# EasyEDA Pro project ProPrj_Shell Controller_2025-04-30.epro

# Schematic Schematic1
Board Name: Board1; Create Date: 2024-11-05; Page Name: P1; Project Name: Shell Controller; Schematic Name: Schematic1; Update Date: 2024-11-13; Company: EasyEDA.com; Drawn: EasyEDA; Page Size: A4; Part Number: JLCPCB-002; Reviewed: EasyEDA; Version: V0.1
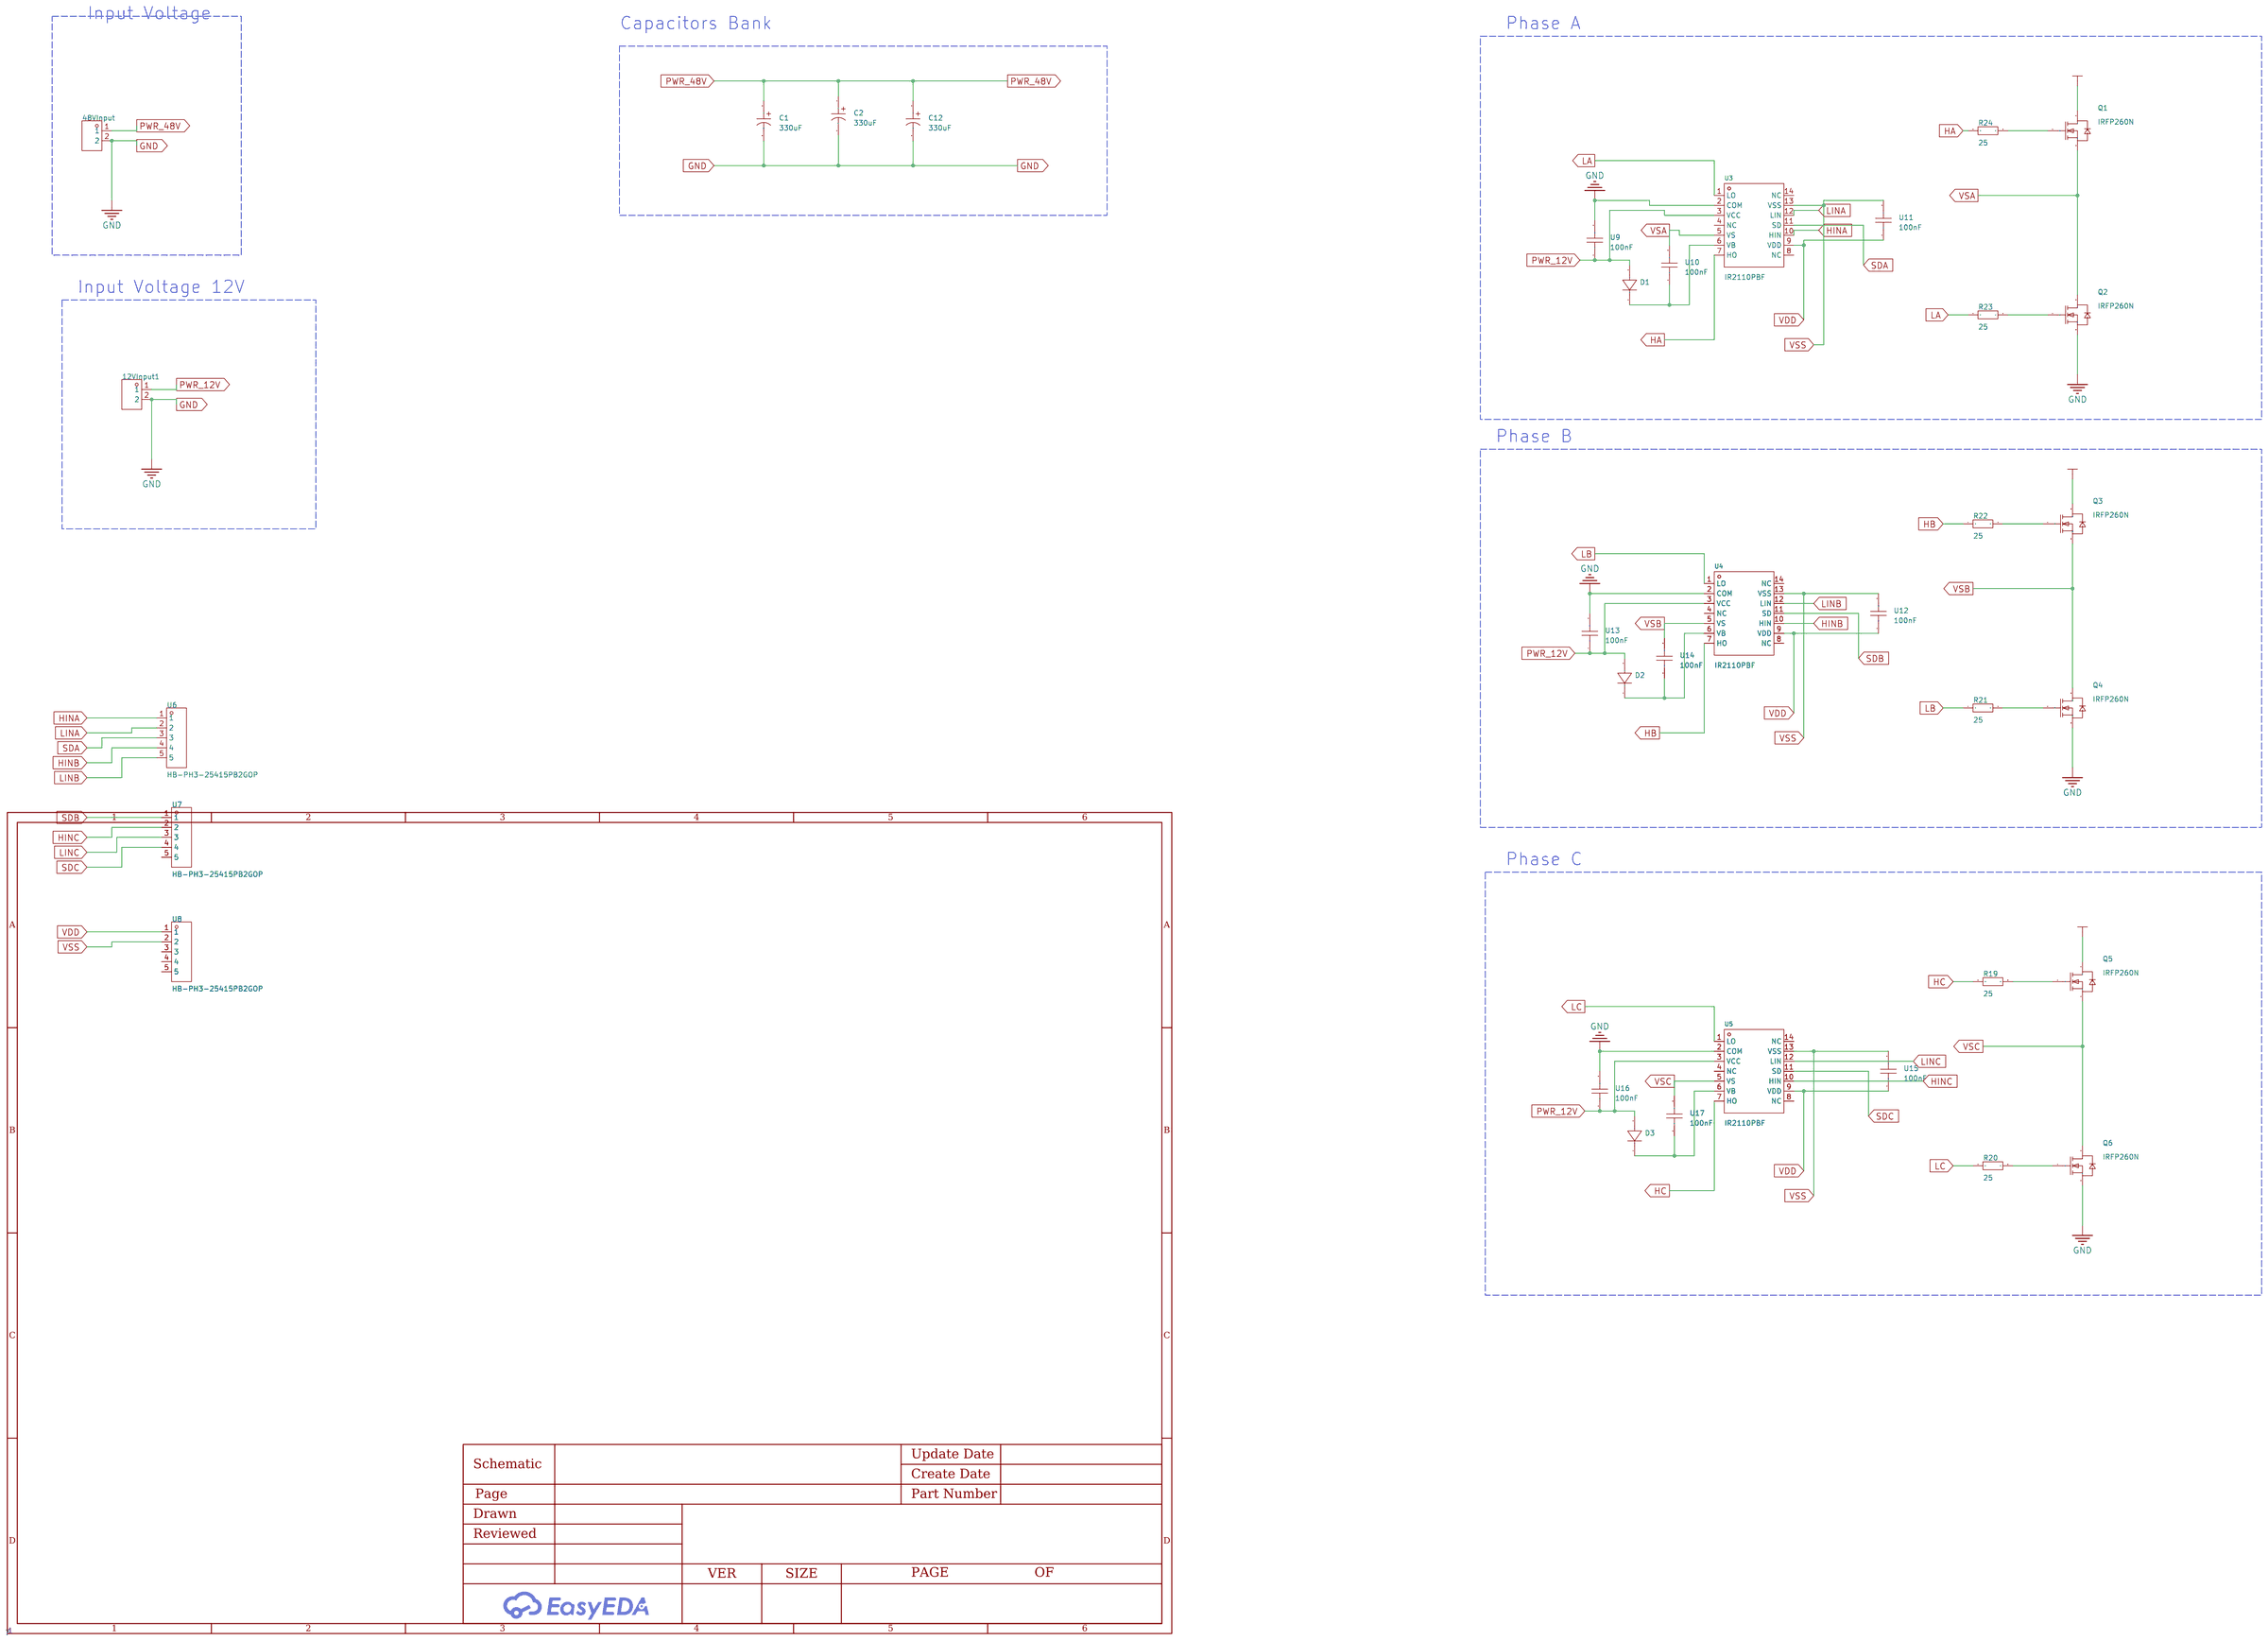
[diagram p0: schematic sheet]

## Parts
12VInput1  DBT50G-9.5-2P-BK-P OGC  [CONN-TH_2P-P9.50_DBT50G-9.5-2P]
48VInput  DBT50G-9.5-2P-BK-P OGC  [CONN-TH_2P-P9.50_DBT50G-9.5-2P]
C1  330uF  [CAP-TH_BD16.0-P7.50-D0.8-FD]
C2  330uF  [CAP-TH_BD16.0-P7.50-D0.8-FD]
C12  330uF  [CAP-TH_BD16.0-P7.50-D0.8-FD]
D1  -  [DO-41_BD2.4-L4.7-P8.70-D0.9-RD]
D2  -  [DO-41_BD2.4-L4.7-P8.70-D0.9-RD]
D3  -  [DO-41_BD2.4-L4.7-P8.70-D0.9-RD]
Q1  IRFP260N  [TO-247-3_L21.0-W15.9-P5.44-L]
Q2  IRFP260N  [TO-247-3_L21.0-W15.9-P5.44-L]
Q3  IRFP260N  [TO-247-3_L21.0-W15.9-P5.44-L]
Q4  IRFP260N  [TO-247-3_L21.0-W15.9-P5.44-L]
Q5  IRFP260N  [TO-247-3_L21.0-W15.9-P5.44-L]
Q6  IRFP260N  [TO-247-3_L21.0-W15.9-P5.44-L]
R19  25  [RES-TH_BD1.8-L3.2-P7.20-D0.4]
R20  25  [RES-TH_BD1.8-L3.2-P7.20-D0.4]
R21  25  [RES-TH_BD1.8-L3.2-P7.20-D0.4]
R22  25  [RES-TH_BD1.8-L3.2-P7.20-D0.4]
R23  25  [RES-TH_BD1.8-L3.2-P7.20-D0.4]
R24  25  [RES-TH_BD1.8-L3.2-P7.20-D0.4]
U3  IR2110PBF  [DIP-14_L20.0-W7.6-P2.54-LS7.6-BL]
U4  IR2110PBF  [DIP-14_L20.0-W7.6-P2.54-LS7.6-BL]
U5  IR2110PBF  [DIP-14_L20.0-W7.6-P2.54-LS7.6-BL]
U6  HB-PH3-25415PB2GOP  [HDR-TH_5P-P2.54-V-M]
U7  HB-PH3-25415PB2GOP  [HDR-TH_5P-P2.54-V-M]
U8  HB-PH3-25415PB2GOP  [HDR-TH_5P-P2.54-V-M]
U9  100nF  [CAP-TH_L5.5-W4.0-P5.00-D0.5]
U10  100nF  [CAP-TH_L5.5-W4.0-P5.00-D0.5]
U11  100nF  [CAP-TH_L5.5-W4.0-P5.00-D0.5]
U12  100nF  [CAP-TH_L5.5-W4.0-P5.00-D0.5]
U13  100nF  [CAP-TH_L5.5-W4.0-P5.00-D0.5]
U14  100nF  [CAP-TH_L5.5-W4.0-P5.00-D0.5]
U15  100nF  [CAP-TH_L5.5-W4.0-P5.00-D0.5]
U16  100nF  [CAP-TH_L5.5-W4.0-P5.00-D0.5]
U17  100nF  [CAP-TH_L5.5-W4.0-P5.00-D0.5]

## Library data of the parts
12VInput1 48VInput = DBT50G-9.5-2P-BK-P OGC: Barrier Type:With Cover Plate Pitch:9.5mm Structure:1x2P Mounting Style:Straight Needle Pin Location:Corner Number of Pins:2P Number of Rows:1 Current Rating (Max):32A Voltage Rating (Max):750V Wire Gauge - AWG:12~22 Wire Gauge - mm2:4 Operating Temperatu; LCSC Part Name: 9.5mm 1x2P 每排P数:2 排数:1 直针 边脚; Supplier Part: C395958; Manufacturer: DORABO(地博电气); Supplier Footprint: 插件,P=9.5mm; JLCPCB Part Class: Extended Part; Datasheet: https://atta.szlcsc.com/upload/public/pdf/source/20230619/13ADDB604F78DE06B1EFD4F82CE20A46.pdf; Supplier: LCSC; Barrier Type: With Cover Plate; Pitch: 9.5mm; Structure: 1x2P; Mounting Style: Straight Needle; Pin Location: Corner; Number of Pins: 2P; Number of Rows: 1; Current Rating (Max): 32A; Voltage Rating (Max): 750V; Wire Gauge - AWG: 12~22; Wire Gauge - mm2: 4; Operating Temperature Range: -40℃~+105℃; Color: Black; Number of PINs Per Row: 2
C1 C2 C12 = SHG330UF100V146EC0462: Capacitance: Tolerance:±20% Tolerance:±20% Rated Voltage: Ripple Current:- Equivalent Series Resistance(ESR):- Lead Spacing:- φD: L: Lifetime @ Temp:10000hrs@105℃ Operating Temperature:- Operating Temperature:-; LCSC Part Name: 330uF ±20% 100V; Supplier Part: C3034842; Manufacturer: KNSCHA(科尼盛); Supplier Footprint: 插件,D16xL20mm; JLCPCB Part Class: Extended Part; Datasheet: https://atta.szlcsc.com/upload/public/pdf/source/20220617/B6D709079D4B0523E96AE75949C6CFF6.pdf; Supplier: LCSC; Tolerance: ±20%; Lifetime @ Temp: 10000hrs@105℃
D1-D3 = 1N4007: Supplier Footprint: DO-41
Q1-Q6 = IRFP260N: Type: Drain Source Voltage (Vdss):- Continuous Drain Current (Id):- Drain Source On Resistance (RDS(on)@Vgs,Id):- Power Dissipation (Pd):- Gate Threshold Voltage (Vgs(th)@Id):- Total Gate Charge (Qg@Vgs):-; LCSC Part Name: N沟道50A 200V; Supplier Part: C33129608; Manufacturer: minos(迈诺斯); Supplier Footprint: TO-247; JLCPCB Part Class: Extended Part; Datasheet: https://atta.szlcsc.com/upload/public/pdf/source/20240723/7BE715932BC9A0E32EEBF4D219A57340.pdf; Supplier: LCSC
R19-R24 = Res_AXIAL-1/8W: Supplier Footprint: Through
U3-U5 = IR2110PBF: Driven Configuration:Half Bridge Load Type:MOSFET；IGBT Number of Drivers:2 Peak Output Current(sink):2A Peak Output Current(source):2A Supply Voltage:3.3V~20V Supply Voltage:3.3V~20V Rise Time:25ns Fall Time:17ns Operating Temperature:-40℃~+150℃@(Tj) Oper; Supplier Part: C2967; Manufacturer: Infineon(英飞凌); Supplier Footprint: DIP-14; JLCPCB Part Class: Extended Part; Datasheet: https://atta.szlcsc.com/upload/public/pdf/source/20190222/C371542_1B779ED12CDCFC0BFEA8323EC05804C9.pdf; Supplier: LCSC; Driven Configuration: Half Bridge; Load Type: MOSFET；IGBT; Number of Drivers: 2; Peak Output Current(sink): 2A; Peak Output Current(source): 2A; Supply Voltage: 3.3V~20V; Rise Time: 25ns; Fall Time: 17ns; Operating Temperature: -40℃~+150℃@(Tj)
U6-U8 = HB-PH3-25415PB2GOP: Pin Structure:1x5P Pitch:2.54mm Row Spacing:2.54mm Circluar Pins/Square Pins:Square Pins Mounting Type:Straight Number of Rows:Plugin Number of Pins:5P Current Rating (Max):3A Voltage Rating (Max):250V Length of Mating Pin:6mm Insulation Height:2.54mm Len; LCSC Part Name: 间距:2.54mm 1x5P 直插 方针; Supplier Part: C6332198; Manufacturer: HANBO(汉博); Supplier Footprint: 插件,P=2.54mm; JLCPCB Part Class: Extended Part; Datasheet: https://atta.szlcsc.com/upload/public/pdf/source/20230803/F72D259687963761DF1B552F3BB84A31.pdf; Supplier: LCSC; Pin Structure: 1x5P; Pitch: 2.54mm; Row Spacing: 2.54mm; Circluar Pins/Square Pins: Square Pins; Mounting Type: Straight; Number of Rows: Plugin; Number of Pins: 5P; Current Rating (Max): 3A; Voltage Rating (Max): 250V; Length of Mating Pin: 6mm; Insulation Height: 2.54mm; Length of End Connection Pin: 3mm; Contact Plating: Gold; Operating Temperature Range: -40℃~+105℃; Soldering Temperature(Max): 260℃; Color: Black
U9-U17 = Y5P102K1KV16CC0008: Capacitance: Tolerance:±10% Tolerance:±10% Voltage Rated: Lead Spacing: Temperature Coefficient: φD:- Body Thickness:-; LCSC Part Name: 1nF ±10% 1kV; Supplier Part: C2887268; Manufacturer: KNSCHA(科尼盛); Supplier Footprint: 插件,P=5mm; JLCPCB Part Class: Extended Part; Datasheet: https://atta.szlcsc.com/upload/public/pdf/source/20210824/9055597E21B72C2A365E56A1D1F6BF4B.pdf; Supplier: LCSC; Tolerance: ±10%

## Nets
GND: 12VInput1.2 48VInput.2 C1.2 C2.2 C12.2 Q2.3(S) Q4.3(S) Q6.3(S) U3.2(COM) U4.2(COM) U5.2(COM) U9.2 U13.2 U16.2
VDD: U3.9(VDD) U4.9(VDD) U5.9(VDD) U8.1 U11.1 U12.1 U15.1
VSS: U3.13(VSS) U4.13(VSS) U5.13(VSS) U8.2 U11.2 U12.2 U15.2
HA: R24.1 U3.7(HO)
HB: R22.1 U4.7(HO)
HC: R19.1 U5.7(HO)
HINA: U3.10(HIN) U6.1
HINB: U4.10(HIN) U6.4
HINC: U5.10(HIN) U7.2
LA: R23.1 U3.1(LO)
LB: R21.1 U4.1(LO)
LC: R20.1 U5.1(LO)
LINA: U3.12(LIN) U6.2
LINB: U4.12(LIN) U6.5
LINC: U5.12(LIN) U7.3
PWR_12V: 12VInput1.1 D1.2(A) D2.2(A) D3.2(A) U3.3(VCC) U4.3(VCC) U5.3(VCC) U9.1 U13.1 U16.1
PWR_48V: 48VInput.1 C1.1 C2.1 C12.1 Q1.2(D) Q3.2(D) Q5.2(D)
SDA: U3.11(SD) U6.3
SDB: U4.11(SD) U7.1
SDC: U5.11(SD) U7.4
VSA: Q1.3(S) Q2.2(D) U3.5(VS) U10.2
VSB: Q3.3(S) Q4.2(D) U4.5(VS) U14.2
VSC: Q5.3(S) Q6.2(D) U5.5(VS) U17.2
$1N2164: Q2.1(G) R23.2
$1N2168: Q1.1(G) R24.2
$1N2515: D1.1(K) U3.6(VB) U10.1
$1N3137: Q4.1(G) R21.2
$1N3139: Q3.1(G) R22.2
$1N3165: D2.1(K) U4.6(VB) U14.1
$1N3640: Q6.1(G) R20.2
$1N3642: Q5.1(G) R19.2
$1N3668: D3.1(K) U5.6(VB) U17.1

Not connected (* = marked no-connect by the designer): U3 4(NC) 8(NC) 14(NC); U4 4(NC) 8(NC) 14(NC); U5 4(NC) 8(NC) 14(NC); U7 5; U8 3 4 5

## Notes on the sheet
- Input Voltage
- Capacitors Bank
- Phase A
- Input Voltage 12V
- Phase B
- Phase C

# Board PCB2
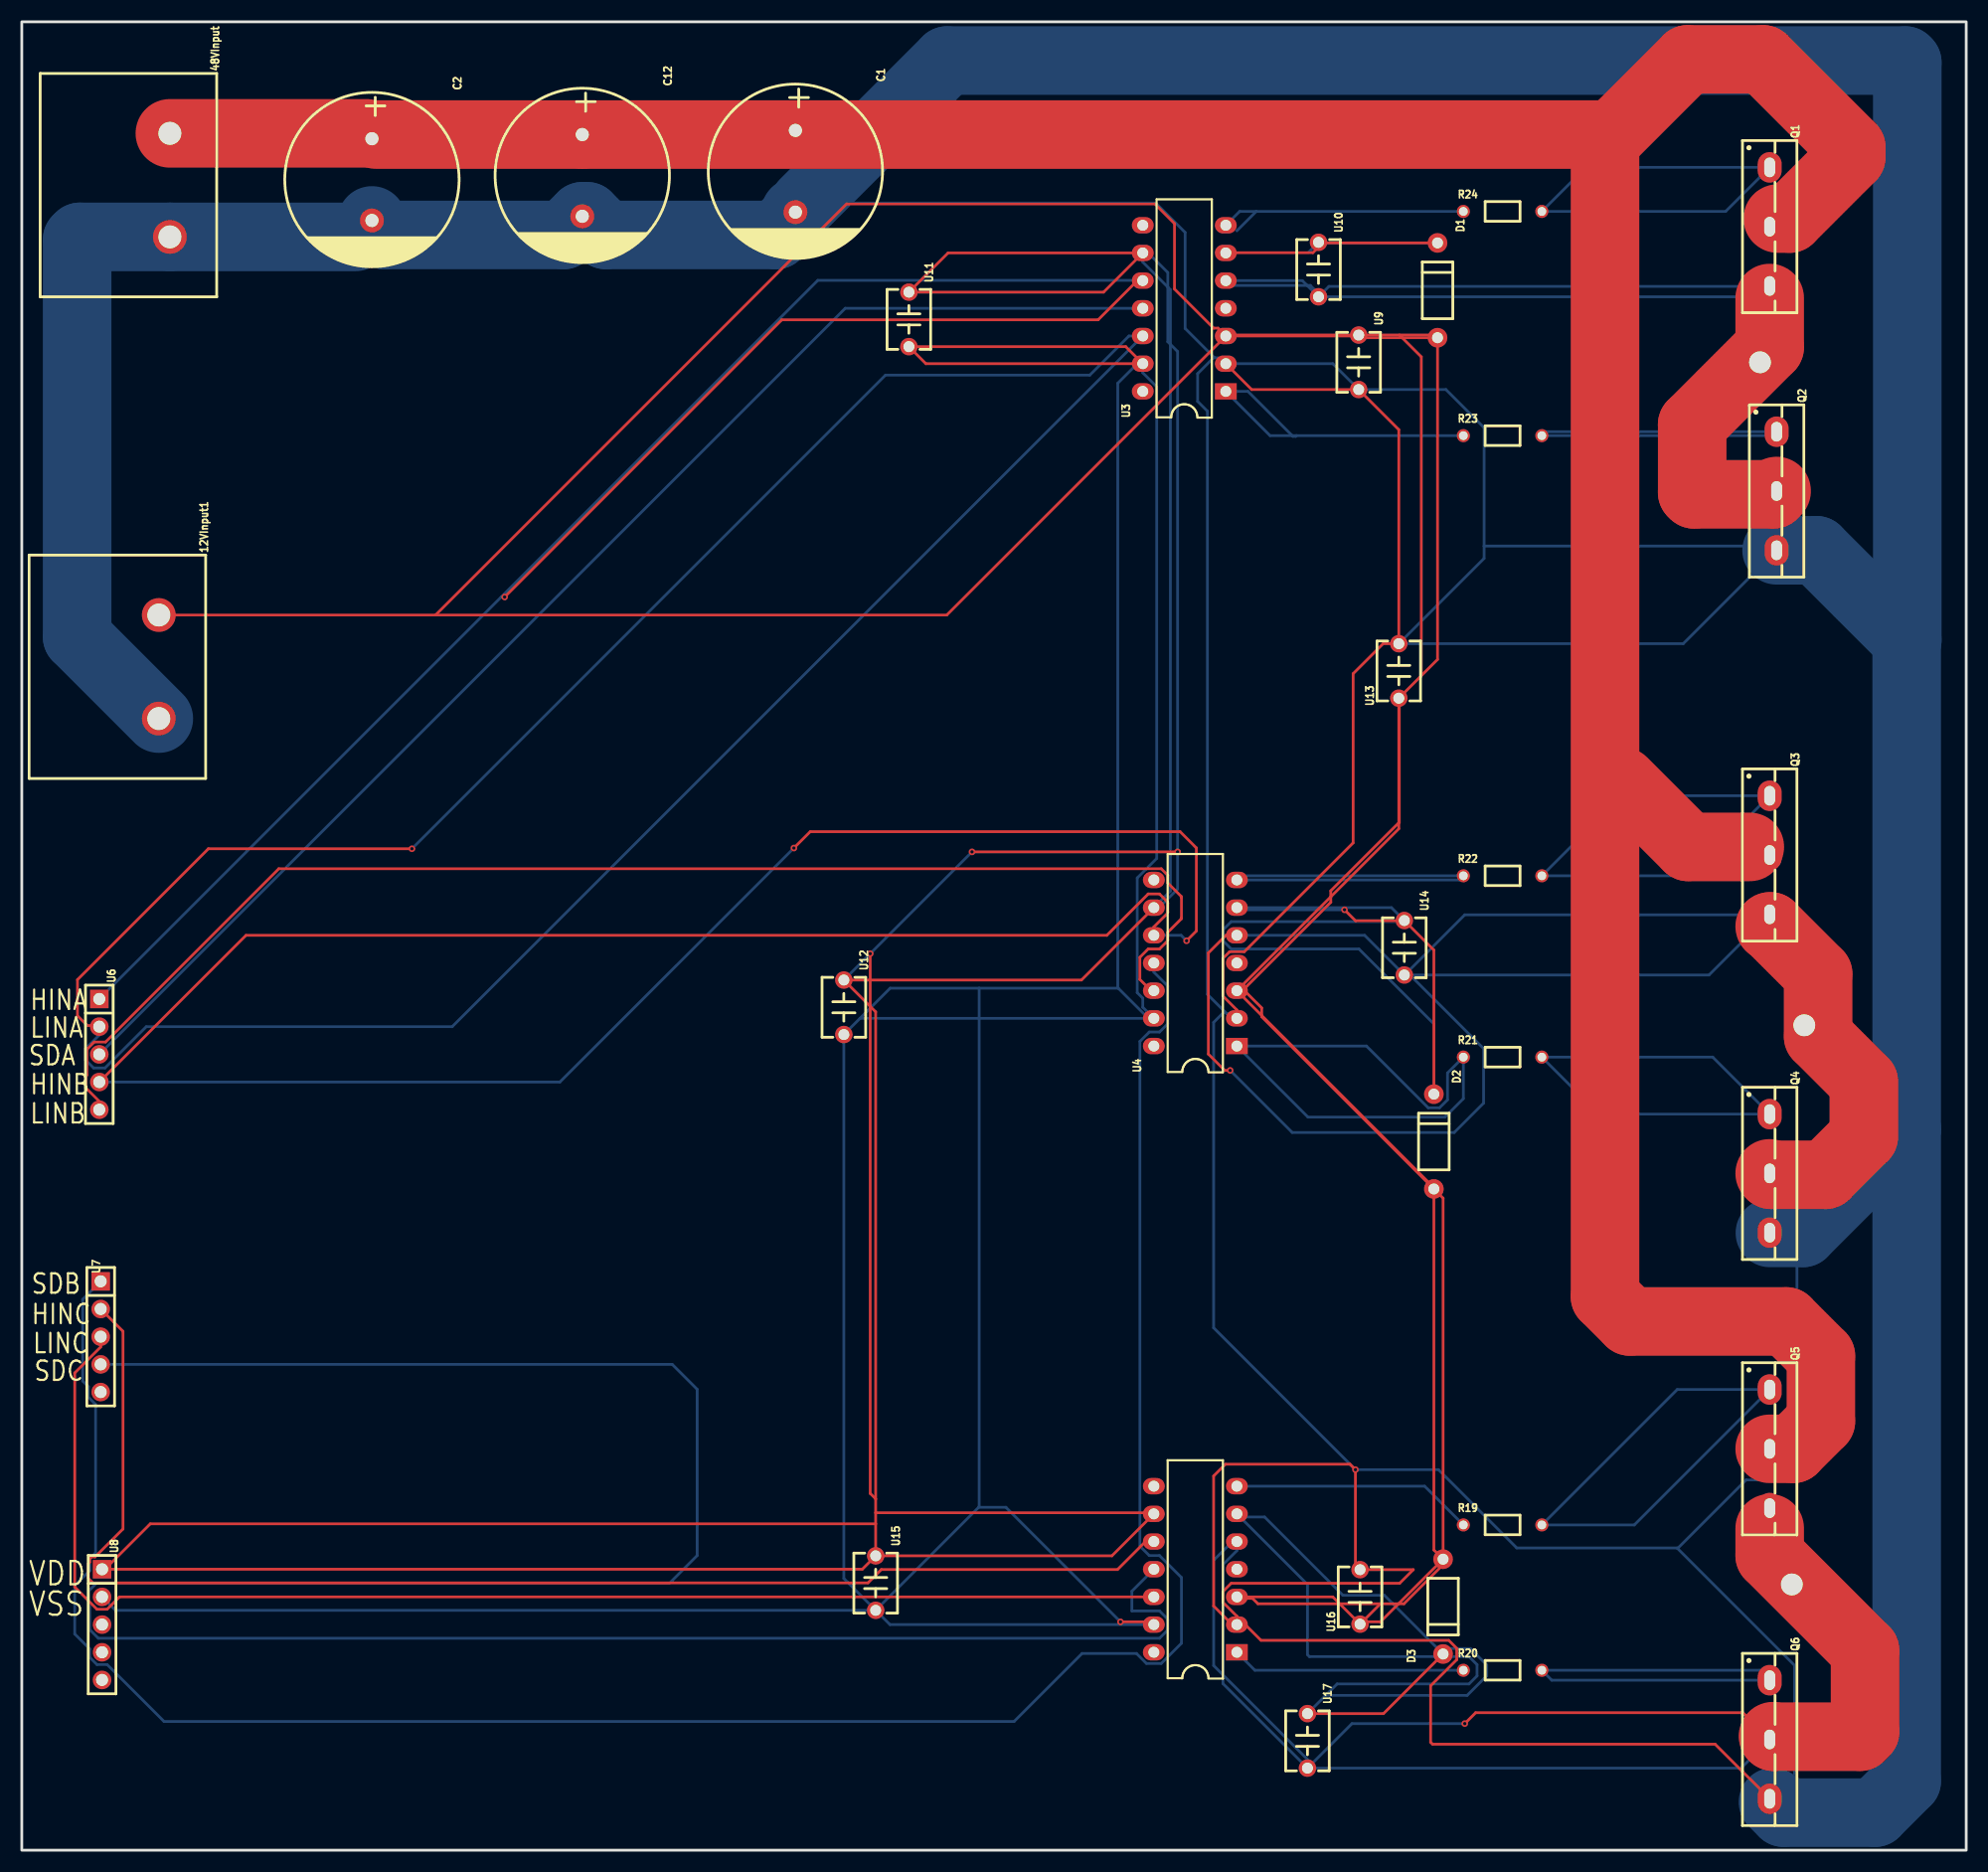
[diagram p1: board, top side]
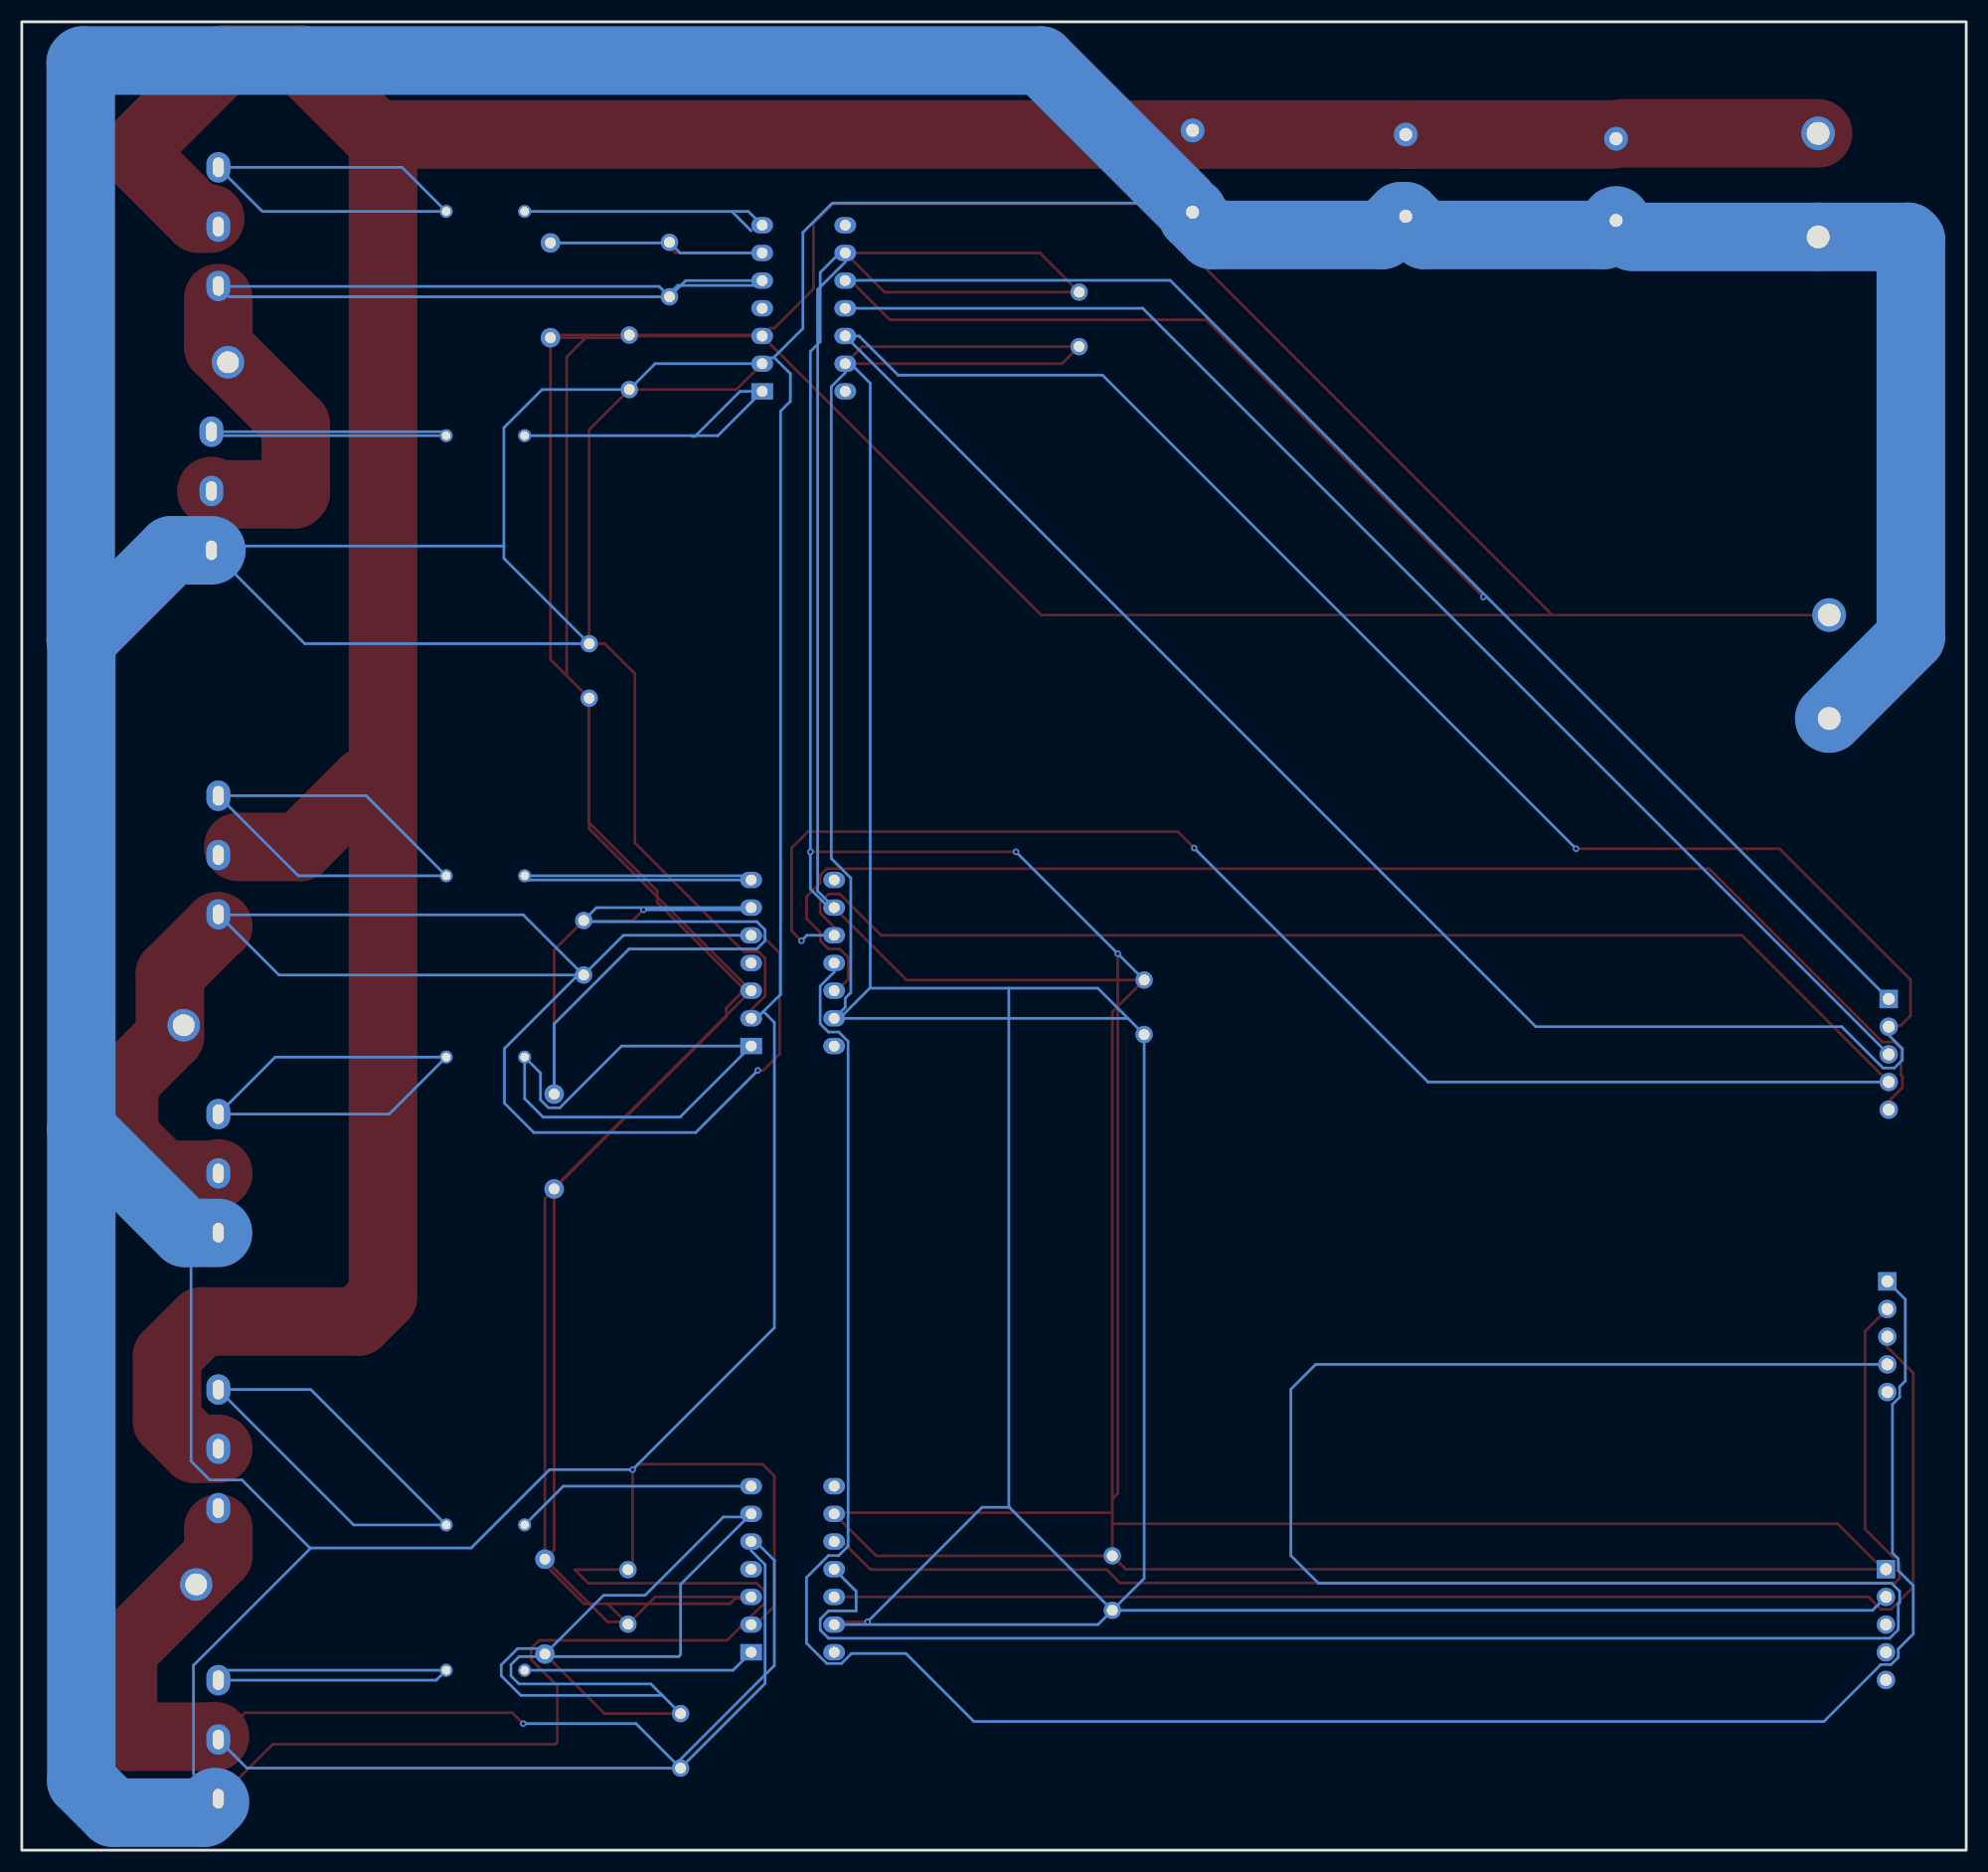
[diagram p2: board, bottom side, seen from below]

Outline 178.44 x 167.77 mm; copper layers: Top Layer, Bottom Layer. Coordinates in mm from the lower left corner of the outline.
Outline path: rectangle 0,167.77 178.44,0
Stack: Top Layer 0.035mm / Dielectric1 1.51mm FR4 er 4.5 / Bottom Layer 0.035mm

## Design rules (mm)
template: Custom Config
spacing copperThickness1oz (default): track to track 1, other pairs 0.152 to 0.3
spacing copperThickness2oz: track to track 0.203, other pairs 0.152 to 0.3
track width copperThickness1oz (default): min 0.127, default 0.254, max 2.54
track width copperThickness2oz: min 0.203, default 0.254, max 2.54
differential pair differentialPair (default): width min 0.127, default 0.254, max 2.54; gap min 0.152, default 0.152
via viaSize (default): diameter min 0.5, default 0.61, max 10; hole min 0.3, default 0.305, max 6.3

## Placement (name value [footprint] x y rotation side)
12VInput1  DBT50G-9.5-2P-BK-P OGC  [CONN-TH_2P-P9.50_DBT50G-9.5-2P]  12.57 108.58 270 top
48VInput  DBT50G-9.5-2P-BK-P OGC  [CONN-TH_2P-P9.50_DBT50G-9.5-2P]  13.59 152.78 270 top
C1  330uF  [CAP-TH_BD16.0-P7.50-D0.8-FD]  70.99 154.05 270 top
C2  330uF  [CAP-TH_BD16.0-P7.50-D0.8-FD]  32.13 153.29 270 top
C12  330uF  [CAP-TH_BD16.0-P7.50-D0.8-FD]  51.43 153.67 270 top
D1  -  [DO-41_BD2.4-L4.7-P8.70-D0.9-RD]  129.92 143.13 270 top
D2  -  [DO-41_BD2.4-L4.7-P8.70-D0.9-RD]  129.58 65.02 270 top
D3  -  [DO-41_BD2.4-L4.7-P8.70-D0.9-RD]  130.43 22.35 90 top
NOREF  -  [Pad_e37]  159.51 136.53 0 top
NOREF#2  -  [Pad_e35]  162.43 24.38 0 top
NOREF#3  -  [Pad_e36]  163.58 75.69 0 top
Q1  IRFP260N  [TO-247-3_L21.0-W15.9-P5.44-L]  160.4 148.97 270 top
Q2  IRFP260N  [TO-247-3_L21.0-W15.9-P5.44-L]  161.04 124.71 270 top
Q3  IRFP260N  [TO-247-3_L21.0-W15.9-P5.44-L]  160.4 91.31 270 top
Q4  IRFP260N  [TO-247-3_L21.0-W15.9-P5.44-L]  160.4 62.1 270 top
Q5  IRFP260N  [TO-247-3_L21.0-W15.9-P5.44-L]  160.4 36.83 270 top
Q6  IRFP260N  [TO-247-3_L21.0-W15.9-P5.44-L]  160.4 10.16 270 top
R19  25  [RES-TH_BD1.8-L3.2-P7.20-D0.4]  135.89 29.84 0 top
R20  25  [RES-TH_BD1.8-L3.2-P7.20-D0.4]  135.89 16.51 0 top
R21  25  [RES-TH_BD1.8-L3.2-P7.20-D0.4]  135.89 72.77 0 top
R22  25  [RES-TH_BD1.8-L3.2-P7.20-D0.4]  135.89 89.41 0 top
R23  25  [RES-TH_BD1.8-L3.2-P7.20-D0.4]  135.89 129.79 0 top
R24  25  [RES-TH_BD1.8-L3.2-P7.20-D0.4]  135.89 150.37 0 top
U3  IR2110PBF  [DIP-14_L20.0-W7.6-P2.54-LS7.6-BL]  106.68 141.48 90 top
U4  IR2110PBF  [DIP-14_L20.0-W7.6-P2.54-LS7.6-BL]  107.7 81.41 90 top
U5  IR2110PBF  [DIP-14_L20.0-W7.6-P2.54-LS7.6-BL]  107.7 25.78 90 top
U6  HB-PH3-25415PB2GOP  [HDR-TH_5P-P2.54-V-M]  7.11 73.02 270 top
U7  HB-PH3-25415PB2GOP  [HDR-TH_5P-P2.54-V-M]  7.24 47.12 270 top
U8  HB-PH3-25415PB2GOP  [HDR-TH_5P-P2.54-V-M]  7.37 20.7 270 top
U9  100nF  [CAP-TH_L5.5-W4.0-P5.00-D0.5]  122.68 136.53 270 top
U10  100nF  [CAP-TH_L5.5-W4.0-P5.00-D0.5]  119 145.03 270 top
U11  100nF  [CAP-TH_L5.5-W4.0-P5.00-D0.5]  81.41 140.46 270 top
U12  100nF  [CAP-TH_L5.5-W4.0-P5.00-D0.5]  75.44 77.34 270 top
U13  100nF  [CAP-TH_L5.5-W4.0-P5.00-D0.5]  126.36 108.2 90 top
U14  100nF  [CAP-TH_L5.5-W4.0-P5.00-D0.5]  126.87 82.8 270 top
U15  100nF  [CAP-TH_L5.5-W4.0-P5.00-D0.5]  78.36 24.51 270 top
U16  100nF  [CAP-TH_L5.5-W4.0-P5.00-D0.5]  122.81 23.24 90 top
U17  100nF  [CAP-TH_L5.5-W4.0-P5.00-D0.5]  117.98 10.03 270 top

## Footprints (pads in the part's own frame, mm; a bottom-side part is the same pattern mirrored in y, then rotated)
CAP-TH_BD16.0-P7.50-D0.8-FD
  round 2.2 hole 1.2: 1(-3.75,0) 2(3.75,0)
CAP-TH_L5.5-W4.0-P5.00-D0.5
  round 1.6 hole 1: 1(-2.5,0) 2(2.5,0)
CONN-TH_2P-P9.50_DBT50G-9.5-2P
  round 3.1 hole 2.1: 1(-4.75,0) 2(4.75,0)
DIP-14_L20.0-W7.6-P2.54-LS7.6-BL
  rect 1.5x2 hole 1: 1(-7.62,-3.81)
  oval 1.5x2 hole 1: 2(-5.08,-3.81) 3(-2.54,-3.81) 4(0,-3.81) 5(2.54,-3.81) 6(5.08,-3.81) 7(7.62,-3.81) 8(7.62,3.81) 9(5.08,3.81) 10(2.54,3.81) 11(0,3.81) 12(-2.54,3.81) 13(-5.08,3.81) 14(-7.62,3.81)
DO-41_BD2.4-L4.7-P8.70-D0.9-RD
  round 1.8 hole 1: 1(-4.35,0) 2(4.35,0)
HDR-TH_5P-P2.54-V-M
  rect 1.7x1.7 hole 1.1: 1(-5.08,0)
  round 1.7 hole 1.1: 2(-2.54,0) 3(0,0) 4(2.54,0) 5(5.08,0)
Pad_e35
  round 3 hole 2: 1(0,0)
Pad_e36
  round 3 hole 2: 2(0,0)
Pad_e37
  round 3 hole 2: 3(0,0)
RES-TH_BD1.8-L3.2-P7.20-D0.4
  round 1.2 hole 0.8: 1(-3.6,0) 2(3.6,0)
TO-247-3_L21.0-W15.9-P5.44-L
  oval 2.8x2.2 hole 1.8x1: 1(-5.44,0) 2(0,0) 3(5.44,0)

## Nets
As in the schematic, except:
VSA: NOREF.3 Q1.3 Q2.2 U3.5 U10.2
VSB: NOREF#3.2 Q3.3 Q4.2 U4.5 U14.2
VSC: NOREF#2.1 Q5.3 Q6.2 U5.5 U17.2

Pads without a net: U3 4 8 14; U4 4 8 14; U5 4 8 14; U7 5; U8 3 4 5

## Via types
v1: diameter 0.61, hole 0.305, Top Layer to Bottom Layer, 12 vias

## Routing (per net, layer and track width the routed paths; a pad name or vN(x,y) marks a point on that pad's centre or on a via; arc(x,y) is an arc through that point)
GND: length 1006.3
  Top Layer w0.254: U4.2 111.51,77.09 110.25,78.35 110.25,78.42 110.23,78.44 110.23,81.83 110.83,82.44 112.18,82.44 122.17,92.43 122.17,107.95 124.93,110.7 U13.2 126.36,130.34 U9.2 112.86,134.03 U3.2 ; 111.51,21.47 U5.2 111.08,20.7 109.37,22.4 109.37,34.34 110.45,35.42 121.88,35.42 v1(122.39,34.92) 122.39,26.16 U16.2 127.69,25.74 126.45,24.5 110.99,24.5 110.25,23.76 110.25,23.69 110.23,23.67 110.23,22.75 111.51,21.47 ; 111.51,21.47 113.72,19.26 130.95,19.26 131.68,18.52 131.68,17.48 129.29,15.09 129.29,9.91 129.47,9.73 155.39,9.73 Q6.3
  Bottom Layer w0.254: 162.68,7 162.68,16.96 151.95,27.69 ; 151.95,27.69 151.9,27.73 137.19,27.73 130.01,34.92 v1(122.39,34.92) 109.37,47.93 109.37,75.96 110.37,76.96 ; 151.95,27.69 158.23,33.97 161.18,33.97 162.9,35.7 162.9,54.16 ; 110.37,76.96 110.6,76.73 111.1,76.73 U4.2 ; 110.37,76.96 108.8,78.53 108.8,132.04 107.9,132.94 107.9,135.48 109.41,136.98 ; 109.41,136.98 109.45,136.94 109.95,136.94 U3.2 120.31,136.4 U9.2 130.69,134.03 134.19,130.52 134.19,119.66 ; 109.41,136.98 106.76,139.63 106.76,148.44 104.06,151.13 71.82,151.13 ; 28.95,146.35 30.62,148.03 ; 134.19,119.66 160.65,119.66 Q2.3 152.47,110.7 U13.2 134.19,118.53 134.19,119.66
  Bottom Layer w4.804: C1.2 71.82,151.13 ; 30.62,148.03 C2.2 ; 160.42,56.64 Q4.3
  Bottom Layer w6.293: 30.62,148.03 48VInput.2 5.33,148.03 5.08,147.78 5.08,111.33 12VInput1.2 ; 172.97,66.17 163.45,56.64 160.42,56.64 ; 172.97,66.17 172.97,111 ; 172.97,66.17 172.97,6.35 170.07,3.45 161.67,3.45 160.7,4.42 ; 172.97,111 164.7,119.27 Q2.3 ; 172.97,111 173.03,111.05 173.03,164.03 172.85,164.21 84.9,164.21 71.82,151.13 ; C2.2 32.13,149.35 33.27,148.21 49.72,148.21 C12.2 51.88,149.92 53.59,148.21 69.22,148.21 70.99,149.99 C1.2
VDD: length 538.4
  Top Layer w0.254: U4.9 97.24,79.84 77.86,79.84 ; 77.86,79.84 77.86,77.42 ; 77.86,79.84 U12.1 77.86,77.42 ; 77.86,79.84 v1(77.86,82.26) ; 77.86,77.42 78.36,76.92 78.36,32.23 ; 77.86,77.42 77.86,32.73 78.36,32.23 ; 78.36,29.95 11.79,29.95 7.79,25.94 U8.1 77.13,25.78 U15.1 ; 78.36,29.95 U15.1 ; 78.36,29.95 78.36,30.96 ; v1(106.06,91.6) v1(87.2,91.6) ; 78.36,30.96 78.36,32.23 ; 78.36,30.96 103.78,30.96 103.89,30.86 100.04,27.01 U15.1 ; 85,146.56 U11.1 99.27,142.96 102.87,146.56 85,146.56
  Bottom Layer w0.254: 105.17,143.43 105.4,143.19 105.4,138.18 ; 105.17,143.43 102.87,145.72 102.87,146.56 103.37,146.56 105.17,144.76 105.17,143.43 ; 105.17,143.43 105.17,138.41 105.4,138.18 ; U12.1 v1(77.86,82.26) v1(87.2,91.6) ; 105.4,138.18 105.4,88 U4.9 104.36,86.49 106.06,88.19 v1(106.06,91.6) 106.06,137.51 105.4,138.18
VSS: length 456.2
  Top Layer w0.254: v1(100.82,20.95) 103.64,20.95 U5.13 ; 82.97,136.4 U11.2 101.31,137.96 102.87,136.4 82.97,136.4
  Bottom Layer w0.254: U4.13 87.85,76.33 ; U4.13 102.87,77.34 102.87,78.18 102.36,78.69 102.36,89.21 104.15,90.99 104.15,134.28 102.87,135.56 102.87,136.4 102.37,136.4 100.57,134.6 100.57,79.14 100.62,79.09 ; U4.13 103.37,76.34 100.62,79.09 ; 87.85,76.33 76.92,76.33 ; 87.85,76.33 87.85,31.51 87.81,31.46 ; 87.85,76.33 87.85,79.09 ; 100.62,79.09 87.85,79.09 ; U15.2 75.44,24.93 U12.2 76.92,76.33 ; U15.2 79.67,20.7 U5.13 ; U15.2 8.6,22.01 U8.2 ; U15.2 87.81,31.46 ; 87.85,79.09 79.69,79.09 76.92,76.33 ; 87.81,31.46 90.31,31.46 v1(100.82,20.95)
HA: length 24.8
  Bottom Layer w0.254: 113.28,150.37 111.76,150.37 U3.7 ; 113.28,150.37 R24.1 ; 113.28,150.37 111.51,148.59
HB: length 41.9
  Bottom Layer w0.254: 111.89,89.41 U4.7 131.91,89.03 R22.1 111.89,89.41
HC: length 22.3
  Bottom Layer w0.254: U5.7 128.73,33.4 R19.1
HINA: length 194
  Top Layer w0.254: v1(44.31,114.99) 69.75,140.43 98.78,140.43 102.37,144.02 102.87,144.02
  Bottom Layer w0.254: U6.1 44,114.99 ; 44,114.99 73.05,144.04 102.78,144.04 102.84,143.98 ; 44,114.99 v1(44.31,114.99)
HINB: length 232
  Top Layer w0.254: v1(106.89,83.45) 107.79,84.34 107.79,91.96 106.29,93.46 72.35,93.46 v1(70.85,91.95) ; U4.10 103.89,84.71 105.14,85.97 105.14,86.04 105.16,86.06 105.16,86.91 105.14,86.94 105.14,87.01 104.41,87.74 103.37,87.74 99.57,83.95 20.57,83.95 U6.4
  Bottom Layer w0.254: v1(70.85,91.95) 49.38,70.48 U6.4 ; v1(106.89,83.45) 106.39,83.95 U4.10
HINC: length 126.6
  Top Layer w0.254: U7.2 9.29,47.61 9.29,29.47 6.72,26.91 6.4,26.91 6.24,26.75 6.24,26.43 6.11,26.3 6.11,24.94 6.53,24.53 77.65,24.53 78.88,25.76 100.56,25.76 103.12,28.32 U5.10
LA: length 31.7
  Bottom Layer w0.254: 116.59,129.79 116.65,129.73 116.9,129.73 116.97,129.79 ; 116.59,129.79 112.52,133.86 U3.1 114.55,129.79 116.59,129.79 ; 116.59,129.79 116.97,129.79 ; 116.97,129.79 R23.1
LB: length 54.5
  Bottom Layer w0.254: 130.59,67.27 118.03,67.27 U4.1 123.4,73.79 129.06,68.12 130.1,68.12 130.84,68.85 130.84,71.32 R21.1 132.29,68.96 130.59,67.27
LC: length 21.5
  Bottom Layer w0.254: U5.1 113.16,16.51 R20.1
LINA: length 256.7
  Top Layer w0.254: v1(35.8,91.89) 17.12,91.89 5.11,79.88 5.11,76.57 6.01,75.67 7.01,75.67 U6.2
  Bottom Layer w0.254: U6.2 7.11,74.8 5.86,73.54 5.86,72.51 6.59,71.77 7.63,71.77 11.43,75.56 39.5,75.56 102.87,138.94 101.6,138.94 98.01,135.35 79.26,135.35 v1(35.8,91.89)
LINB: length 126.8
  Top Layer w0.254: 103.94,78.92 U4.12 103.63,78.87 102.6,79.9 102.6,81.93 103.37,82.69 104.41,82.69 105.14,83.43 105.14,83.5 105.16,83.52 105.16,84.22 106.39,85.45 106.39,85.52 106.42,85.54 106.42,87.43 106.39,87.46 106.39,87.53 105.16,88.75 105.16,89.45 104.56,90.06 23.59,90.06 7.68,74.15 6.64,74.15 5.98,73.49 5.98,71.13 5.86,71 5.86,69.97 7.45,68.38 7.45,68.12 7.27,67.94 U6.5
LINC: length 124.3
  Top Layer w0.254: 103.89,23.24 8.96,23.24 7.83,22.11 6.9,22.11 4.86,24.15 4.86,43.79 7.24,46.17 U7.3
PWR_12V: length 543.4
  Top Layer w0.254: D3.2 130.43,26.2 126.84,22.61 126.34,22.61 ; D3.2 130.43,59.83 D2.2 ; D3.2 126.34,22.61 ; D3.2 129.58,27.55 D2.2 ; 126.36,94.27 120.12,88.03 120.12,87.48 ; 126.36,94.27 126.36,93.73 120.12,87.48 ; 126.36,94.27 126.41,94.32 126.41,105.75 ; 126.36,94.27 U13.1 126.41,105.75 ; 113.78,76.59 129.58,60.79 D2.2 ; 113.78,76.59 U4.3 ; 113.78,76.59 113.78,76.47 D2.2 ; 113.78,76.59 113.78,77.28 111.99,79.08 ; 126.43,139.03 126.67,138.78 ; 126.43,139.03 U9.1 ; 126.43,139.03 129.67,139.03 D1.2 ; 126.67,138.78 122.93,138.78 U9.1 ; 126.67,138.78 128.43,137.02 128.43,107.77 ; 126.67,138.78 D1.2 ; 123.02,20.95 122.99,20.95 122.81,20.78 ; 123.02,20.95 124.68,22.61 ; 123.02,20.95 U16.1 120.94,22.61 ; 123.02,20.95 124.68,20.95 126.34,22.61 ; 128.43,107.77 126.41,105.75 ; 128.43,107.77 129.92,109.26 D1.2 ; 111.99,79.08 U4.3 ; 111.99,79.08 112.4,79.26 120.12,86.98 120.12,87.48 ; U4.3 120.12,87.48 ; 126.34,22.61 124.68,22.61 ; 124.68,22.61 120.94,22.61 ; U3.3 109.77,139.66 109.37,139.66 105.78,143.25 105.78,149.26 103.98,151.05 75.69,151.05 37.97,113.33 ; U3.3 110.58,139.03 U9.1 ; U3.3 84.89,113.33 37.97,113.33 ; U3.3 122.59,138.94 U9.1 ; 120.94,22.61 113.44,22.61 112.94,23.11 112.36,23.11 111.51,23.24 120.31,23.24 120.94,22.61 ; 37.97,113.33 12VInput1.1
PWR_48V: length 324.2
  Top Layer w6.292: Q5.2 162.56,36.83 165.1,39.37 165.1,45.34 161.92,48.51 147.57,48.51 145.29,50.8 145.29,156.74 145.7,157.15 145.43,157.42 C12.1
  Top Layer w6.293: C12.1 32.51,157.42 ; 48VInput.1 31.64,157.53 ; 145.7,157.15 152.87,164.32 159.8,164.32 167.89,156.22 167.89,155.38 162.22,149.71 161.14,149.71 ; 146.94,98.04 152.93,92.06 158.58,92.06
SDA: length 124.1
  Bottom Layer w0.254: 102.87,141.48 75.56,141.48 U6.3
SDB: length 210.1
  Bottom Layer w0.254: U4.11 103.89,80.57 105.16,79.29 105.16,75.83 104.41,75.07 103.47,75.07 102.61,74.21 102.61,27.9 103.47,27.03 104.41,27.03 106.42,25.02 106.42,18.99 104.56,17.13 103.21,17.13 102.29,18.05 97.3,18.05 91.06,11.81 13.05,11.81 7.83,17.03 6.9,17.03 6.24,17.69 6.24,18.46 4.86,19.84 4.86,24.28 6.24,25.66 6.24,26.75 6.77,27.28 6.77,40.91 6.11,41.57 6.11,42.53 5.59,43.05 5.59,50.55 U7.1
SDC: length 240.6
  Bottom Layer w0.254: U7.4 59.69,44.58 61.98,42.29 61.98,27.03 59.44,24.5 6.85,24.5 6.11,23.76 6.11,22.72 6.24,22.6 6.24,20.23 7.02,19.45 104.41,19.45 105.14,20.18 105.14,20.25 105.16,20.28 105.16,21.13 105.14,21.15 105.14,21.22 104.41,21.95 101.87,21.95 101.87,23.76 U5.11
VSA: length 130.6
  Top Layer w6.293: 160.4,142.42 160.4,137.92 153.29,130.81 153.29,124.59 153.47,124.41 160.73,124.41 Q2.2
  Bottom Layer w0.254: 117.96,143.58 110.93,143.58 U3.5 117.51,144.02 117.96,143.58 ; 117.96,143.58 U10.2 ; 117.96,143.58 118.25,143.58 119.14,142.68 ; U10.2 119.14,142.68 ; U10.2 159.4,142.53 160.36,143.49 119.95,143.49 119.14,142.68
VSB: length 177.8
  Top Layer w0.254: U4.5 110.5,83.95 108.89,82.33 108.89,73.05 110.39,71.55 v1(110.89,71.55)
  Top Layer w6.293: 160.4,84.76 160.47,84.76 164.85,80.39 164.85,74.68 169.04,70.48 169.04,65.5 165.51,61.98 160.53,61.98 Q4.2
  Bottom Layer w0.254: U4.5 123.23,83.95 U14.2 127.14,80.56 ; 127.39,80.3 154.83,80.3 160.36,85.83 132.42,85.83 127.41,80.82 127.14,80.56 ; 127.39,80.3 127.14,80.56 ; 127.39,80.3 134.15,73.55 134.15,68.55 131.45,65.85 116.59,65.85 v1(110.89,71.55) ; 160.4,85.87 160.45,85.83
VSC: length 169.8
  Top Layer w0.254: Q6.2 157.94,12.62 133.42,12.62 v1(132.42,11.62)
  Top Layer w6.293: 160.4,29.54 160.4,27.05 169.15,18.3 169.15,10.89 168.68,10.41 160.75,10.41 160.7,10.46
  Bottom Layer w0.254: Q6.2 157.77,7.53 U17.2 ; U17.2 110.23,15.29 110.23,16.09 ; U17.2 118.38,7.93 ; 118.38,7.93 110.23,16.09 ; 118.38,7.93 122.07,11.62 v1(132.42,11.62) ; 110.23,16.09 110.23,26.21 111.51,27.49 U5.5 111.09,28.32 109.38,26.6 109.38,16.94 110.23,16.09
$1N2164: length 43.4
  Bottom Layer w0.254: 139.85,130.15 R23.2 160.68,129.79 Q2.1 139.85,130.15
$1N2168: length 45.2
  Bottom Layer w0.254: 156.36,150.37 Q1.1 143.53,154.41 R24.2 156.36,150.37
$1N2515: length 40.1
  Top Layer w0.254: 119.38,147.48 118.48,146.58 110.51,146.58 U3.6 ; 119.38,147.48 D1.1 ; 119.38,147.48 119.05,147.48 U10.1
  Bottom Layer w0.254: D1.1 119.05,147.48 U10.1 118.02,146.56 U3.6
$1N3137: length 46.2
  Bottom Layer w0.254: 144.72,67.54 R21.2 155.17,72.77 Q4.1 144.72,67.54
$1N3139: length 47.9
  Bottom Layer w0.254: 153.06,89.41 Q3.1 146.83,96.75 R22.2 153.06,89.41
$1N3165: length 95.7
  Top Layer w0.254: v1(121.38,86.29) 122.38,85.29 126.89,85.29 ; 126.89,85.29 129.58,82.59 D2.1 ; 126.89,85.29 U14.1
  Bottom Layer w0.254: D2.1 129.58,75.82 122.71,82.69 110.99,82.69 110.23,83.45 110.23,84.37 110.25,84.4 110.25,84.47 110.99,85.2 126.77,85.2 U14.1 125.69,86.49 U4.6 111.7,86.29 v1(121.38,86.29)
$1N3640: length 42.6
  Bottom Layer w0.254: 140.4,15.6 R20.2 159.49,16.51 Q6.1 140.4,15.6
$1N3642: length 52.1
  Bottom Layer w0.254: R19.2 147.98,29.84 Q5.1 151.91,42.27 R19.2
$1N3668: length 109.5
  Top Layer w0.254: D3.1 124.96,12.53 U17.1
  Bottom Layer w0.254: 111.79,30.57 114.05,30.57 121.23,23.39 125.04,23.39 D3.1 130.93,18.5 132.93,18.5 134.43,17 134.43,16 132.64,14.2 119.65,14.2 ; 111.79,30.57 111.51,30.86 ; 111.79,30.57 117.98,24.38 117.98,17.94 118.16,17.76 132.81,17.76 133.54,17.03 133.54,15.99 132.81,15.26 120.71,15.26 119.65,14.2 ; 119.65,14.2 U17.1

## Text on the board
Top Silkscreen Layer: SDA | HINA | LINA | HINB | LINB | SDB | HINC | LINC | SDC | VDD | VSS
